# EAGLE schematic apa102-controller (EAGLE 7.1.0)
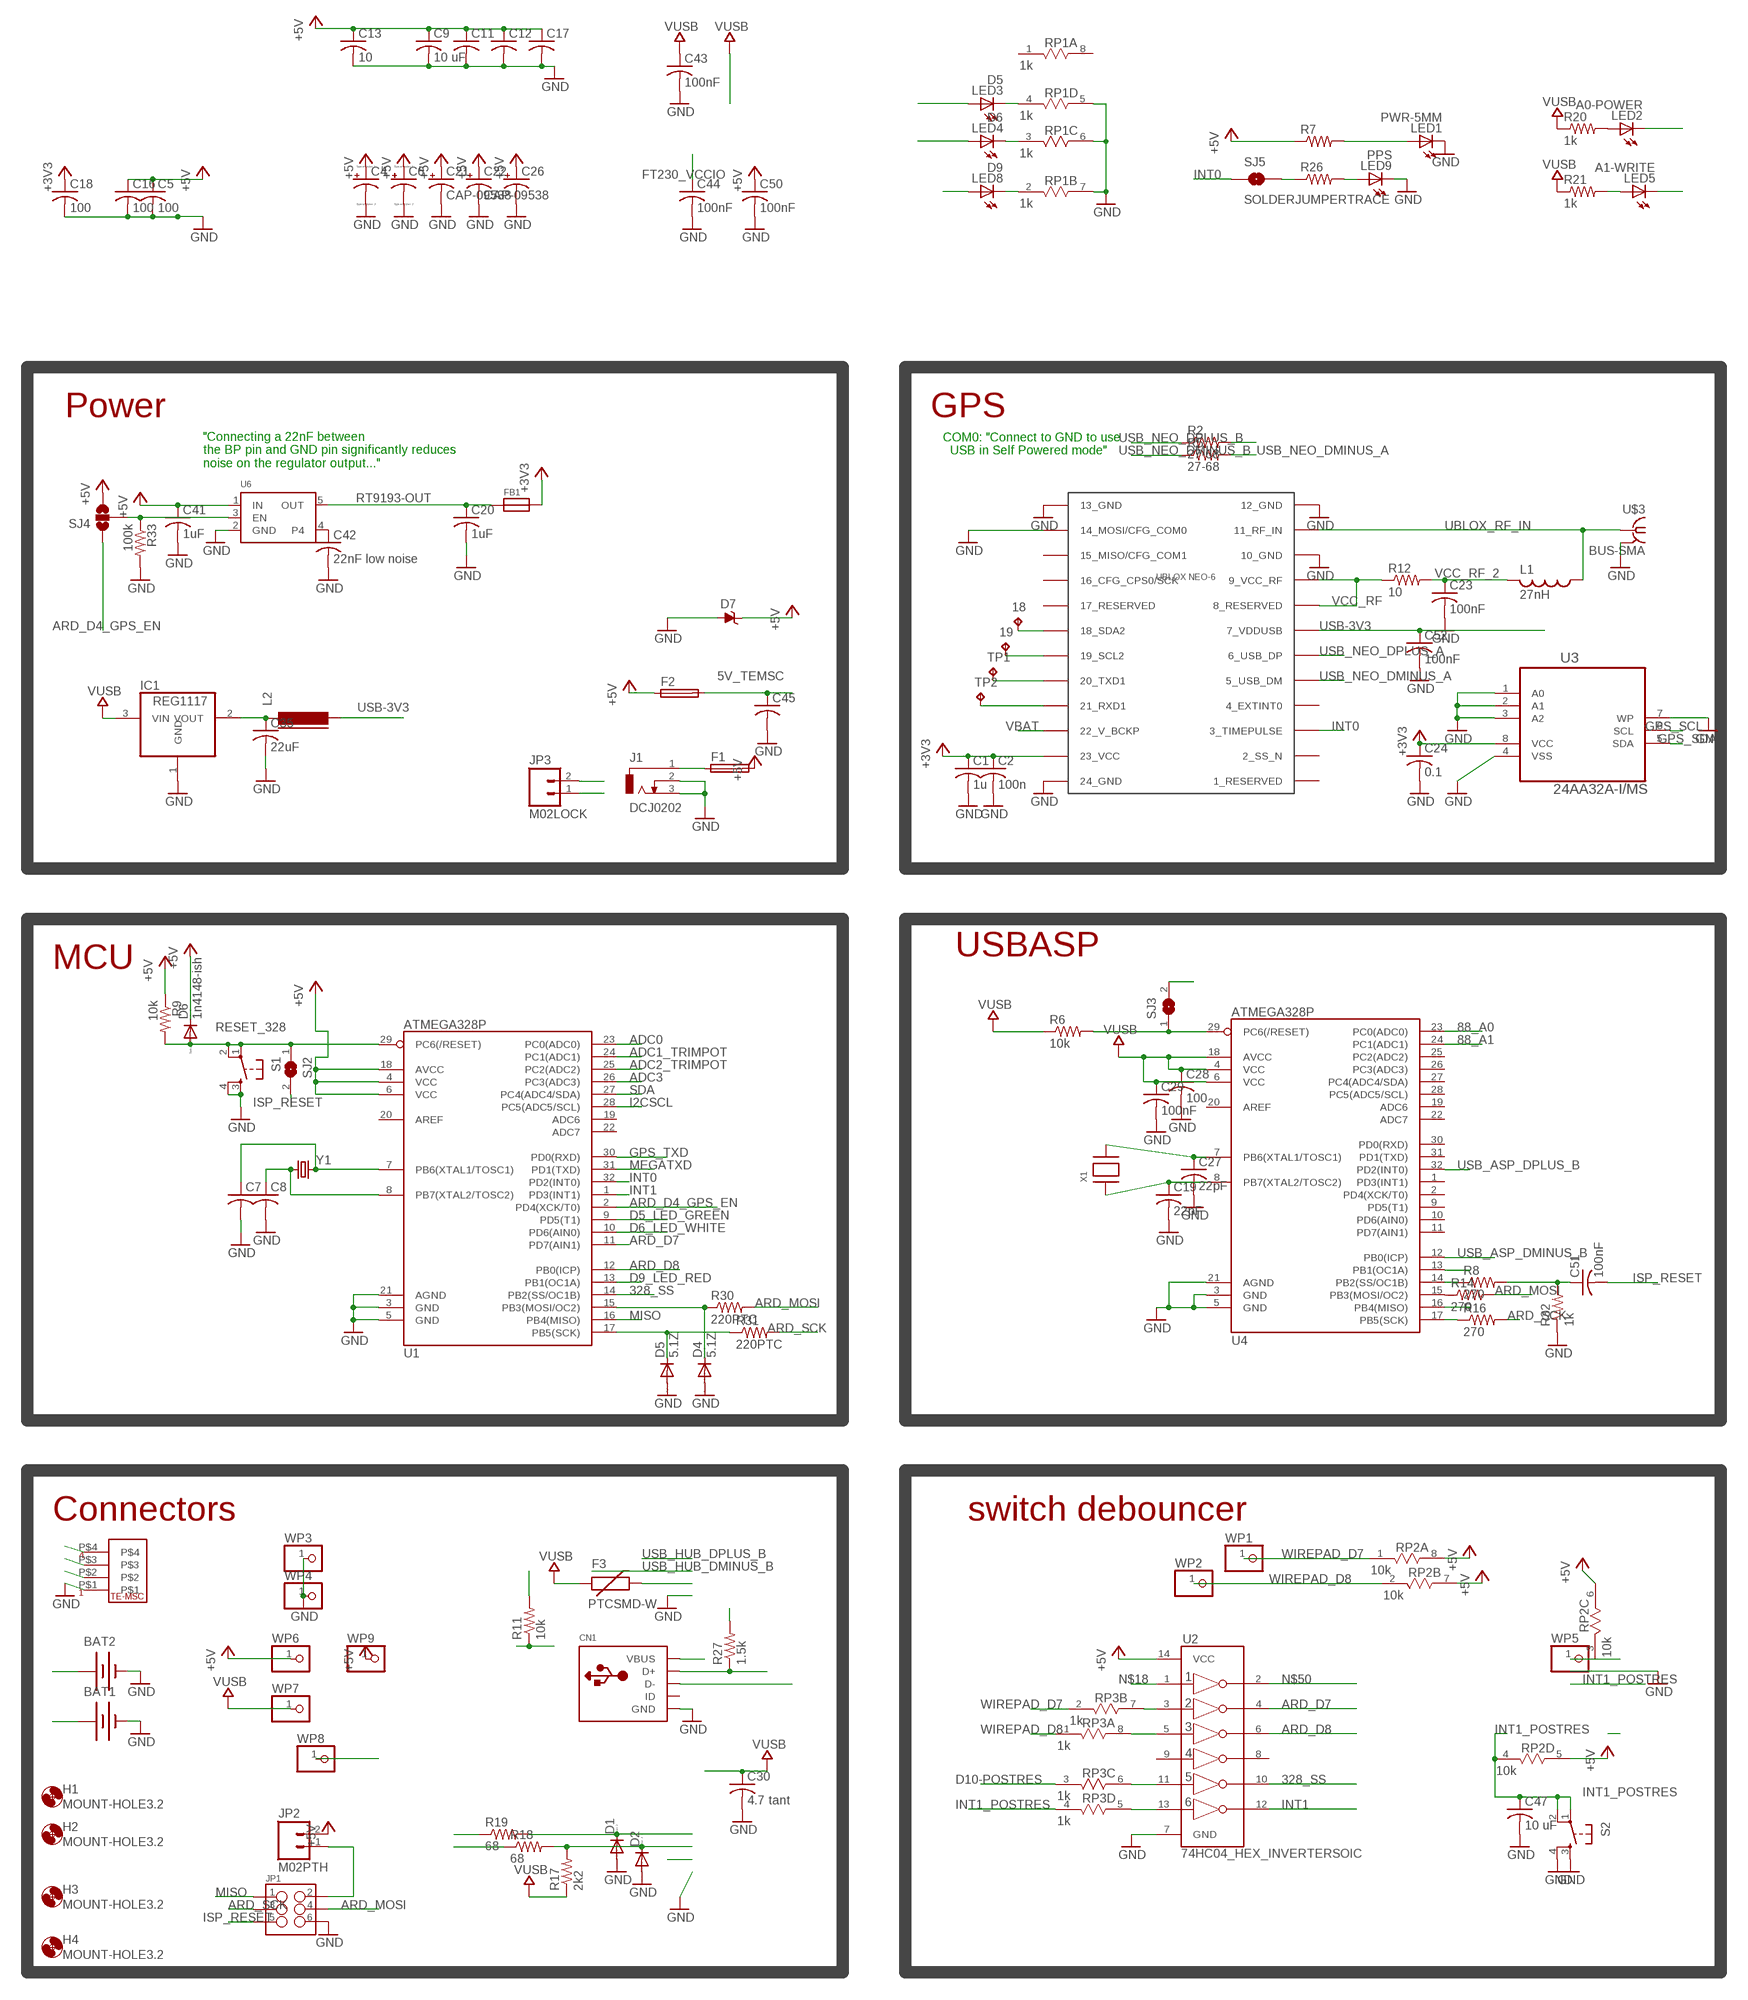
[diagram p0: schematic, sheet 1, part 1 of 2]
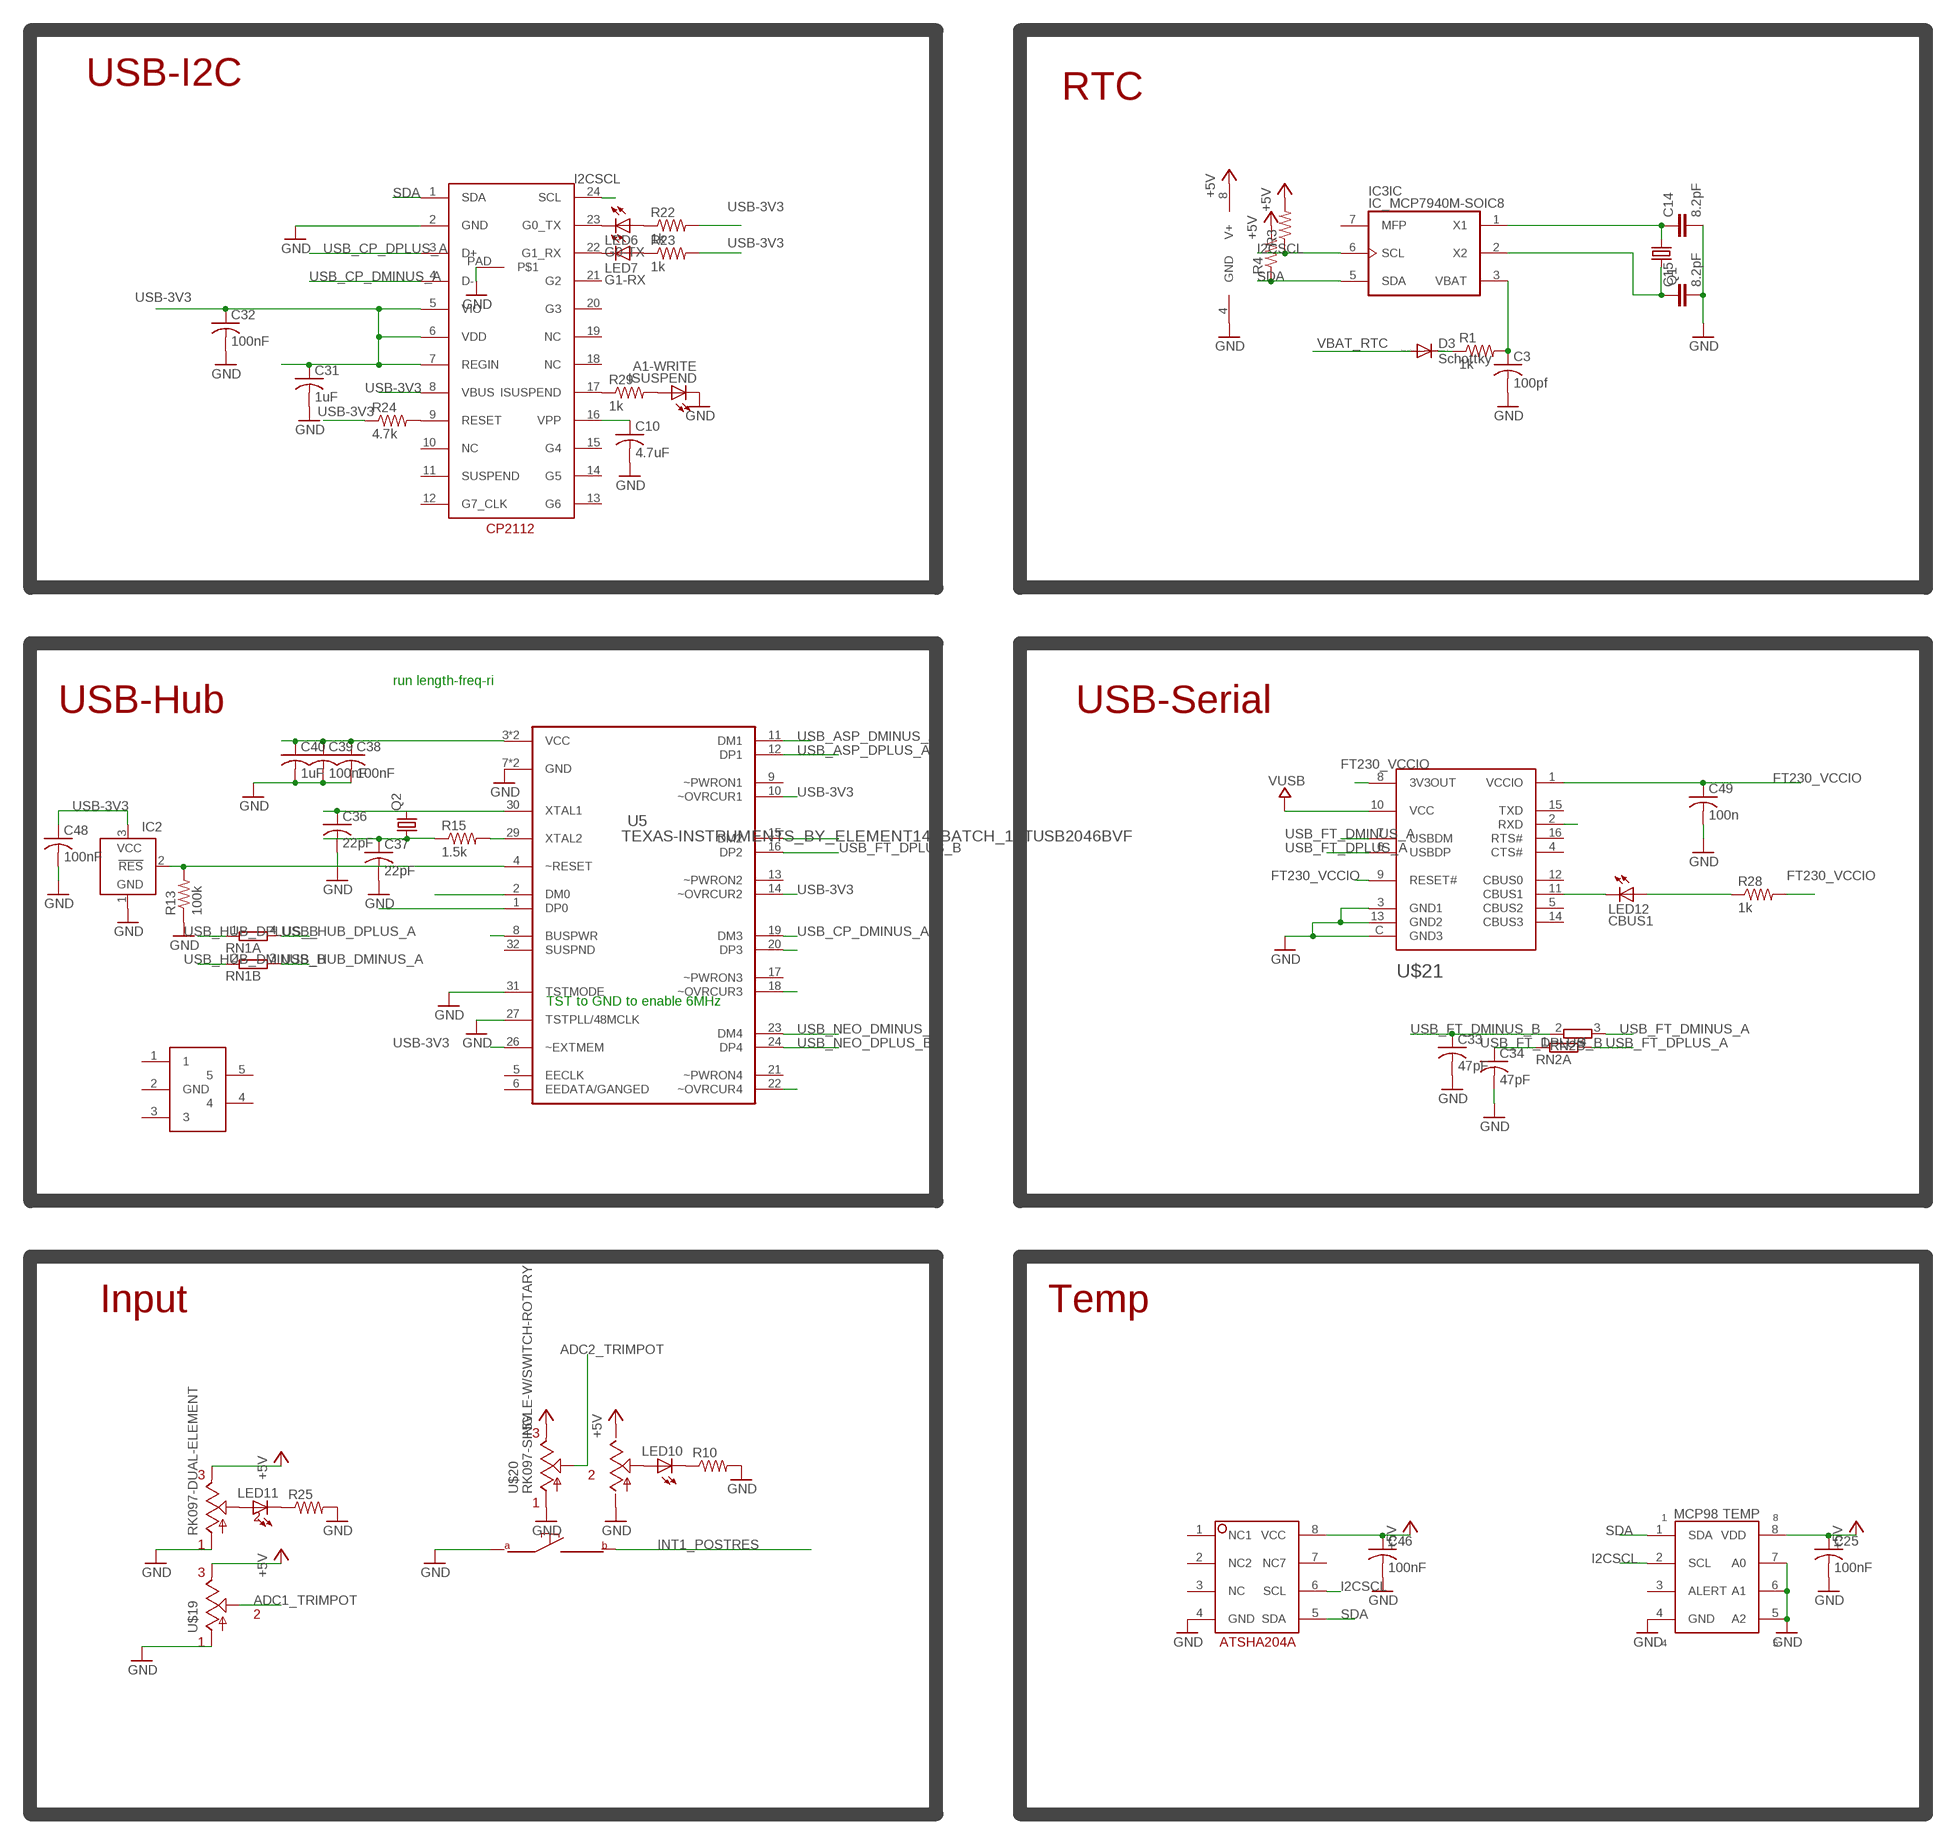
[diagram p1: schematic, sheet 1, part 2 of 2]

## Parts
18  TPTP10SQ  [TP10SQ]
19  TPTP10SQ  [TP10SQ]
BAT1  BATTERY12MM  [BATTCON_12MM]
BAT2  BATTERY12MM  [BATTCON_12MM]
C1  1u  C-USC0805  [C0805]
C2  100n  C-USC0805  [C0805]
C3  100pf  C-USC0805  [C0805]
C4  CPOL-USE5-5  [E5-5]
C5  100  C-USC0805  [C0805]
C6  CPOL-USE5-5  [E5-5]
C7  C-USC0805  [C0805]
C8  C-USC0805  [C0805]
C9  10 uF  C-USC0805  [C0805]
C10  4.7uF  C-USC0805  [C0805]
C11  C-USC0805  [C0805]
C12  C-USC0805  [C0805]
C13  10  C-USC0805  [C0805]
C14  8.2pF  CAP0603-CAP  [0603-CAP]
C15  8.2pF  CAP0603-CAP  [0603-CAP]
C16  100  C-USC0805  [C0805]
C17  C-USC0805  [C0805]
C18  100  C-USC0805  [C0805]
C19  22pF  C-USC0805  [C0805]
C20  1uF  C-USC0805  [C0805]
C21  CAP-09538  1000UF-25V(PTH)  [CPOL-RADIAL-1000UF-25V]
C22  CAP-09538  1000UF-25V(PTH)  [CPOL-RADIAL-1000UF-25V]
C23  100nF  C-USC0805  [C0805]
C24  0.1  C-USC0805  [C0805]
C25  100nF  C-USC0805  [C0805]
C26  10UF-25V-20%(PTH)KIT  [CPOL-RADIAL-10UF-25V-KIT]
C27  22pF  C-USC0805  [C0805]
C28  100  C-USC0805  [C0805]
C29  100nF  C-USC0805  [C0805]
C30  4.7 tant  C-USC0805  [C0805]
C31  1uF  C-USC0805  [C0805]
C32  100nF  C-USC0805  [C0805]
C33  47pF  C-USC0805  [C0805]
C34  47pF  C-USC0805  [C0805]
C35  22uF  C-USC0805  [C0805]
C36  22pF  C-USC0805  [C0805]
C37  22pF  C-USC0805  [C0805]
C38  100nF  C-USC0805  [C0805]
C39  100nF  C-USC0805  [C0805]
C40  1uF  C-USC0805  [C0805]
C41  1uF  C-USC0805  [C0805]
C42  22nF low noise  C-USC0805  [C0805]
C43  100nF  C-USC0805  [C0805]
C44  100nF  C-USC0805  [C0805]
C45  C-USC1206K  [C1206K]
C46  100nF  C-USC0805  [C0805]
C47  10 uF  C-USC0805  [C0805]
C48  100nF  C-USC0805  [C0805]
C49  100n  C-USC0805  [C0805]
C50  100nF  C-USC0805  [C0805]
C51  100nF  C-USC0805  [C0805]
C52  100nF  C-USC0805  [C0805]
CN1  USBMINIB  [USB-MINIB]
D1  DIODE-MINIMELF  [MINIMELF@1]
D2  DIODE-MINIMELF  [MINIMELF@1]
D3  Schottky  DIODE-SOD323-W  [SOD323-W@1]
D4  5.1Z  DIODE-SOD323-W  [SOD323-W@1]
D5  5.1Z  DIODE-SOD323-W  [SOD323-W@1]
D6  1n4148-ish  DIODE-SOD323-W  [SOD323-W@1]
D7  ZENER-DIODEDO41Z10  [DO41Z10]
F1  LITTLEFUSE  [LITTLEFUSE]
F2  LITTLEFUSE  [LITTLEFUSE]
F3  PTCSMD-W  [PTC-1206-WIDE]
FB1  FERRITE0805  [0805]
H1  MOUNT-HOLE3.2  [3,2]
H2  MOUNT-HOLE3.2  [3,2]
H3  MOUNT-HOLE3.2  [3,2]
H4  MOUNT-HOLE3.2  [3,2]
IC1  REG1117  [SOT223]
IC2  TCM809  [SOT23B-3]
IC3  IC_MCP7940M-SOIC8  [SOIC-8]
ISUSPEND  A1-WRITE  LEDCHIP-LED0805  [CHIP-LED0805]
J1  DCJ0202  [DCJ0202]
JP1  M03X2SHROUD  [2X3-SHROUDED]
JP2  M02PTH  [1X02]
JP3  M02LOCK  [1X02_LOCK]
L1  27nH  INDUCTORM0805  [M0805]
L2  FERRITE-1206  [FB1206]
LED1  PWR-5MM  LED5MM  [LED5MM]
LED2  A0-POWER  LEDCHIP-LED0805  [CHIP-LED0805]
LED3  D5  LEDCHIP-LED0805  [CHIP-LED0805]
LED4  D6  LEDCHIP-LED0805  [CHIP-LED0805]
LED5  A1-WRITE  LEDCHIP-LED0805  [CHIP-LED0805]
LED6  G0-TX  LEDCHIP-LED0805  [CHIP-LED0805]
LED7  G1-RX  LEDCHIP-LED0805  [CHIP-LED0805]
LED8  D9  LEDCHIP-LED0805  [CHIP-LED0805]
LED9  PPS  LEDCHIP-LED0805  [CHIP-LED0805]
LED10  LEDCHIP-LED0805  [CHIP-LED0805]
LED11  LEDCHIP-LED0805  [CHIP-LED0805]
LED12  CBUS1  LEDCHIP-LED0805  [CHIP-LED0805]
Q1  CRYSTALMM20SS  [MM20SS]
Q2  CRYSTALHC49UP  [HC49UP]
R1  1k  R-US_R0805  [R0805]
R2  27-68  R-US_R0805  [R0805]
R3  R-US_R0805  [R0805]
R4  R-US_R0805  [R0805]
R5  27-68  R-US_R0805  [R0805]
R6  10k  R-US_R0805  [R0805]
R7  R-US_R0805  [R0805]
R8  270  R-US_R0805  [R0805]
R9  10k  R-US_R0805  [R0805]
R10  R-US_R0805  [R0805]
R11  10k  R-US_R0805  [R0805]
R12  10  R-US_R0805  [R0805]
R13  100k  R-US_R0805  [R0805]
R14  270  R-US_R0805  [R0805]
R15  1.5k  R-US_R0805  [R0805]
R16  270  R-US_R0805  [R0805]
R17  2k2  R-US_R0805  [R0805]
R18  68  R-US_R0805  [R0805]
R19  68  R-US_R0805  [R0805]
R20  1k  R-US_R0805  [R0805]
R21  1k  R-US_R0805  [R0805]
R22  1k  R-US_R0805  [R0805]
R23  1k  R-US_R0805  [R0805]
R24  4.7k  R-US_R0805  [R0805]
R25  R-US_R0805  [R0805]
R26  R-US_R0805  [R0805]
R27  1.5k  R-US_R0805  [R0805]
R28  1k  R-US_R0805  [R0805]
R29  1k  R-US_R0805  [R0805]
R30  220PTC  RESISTOR0603-RES  [0603-RES]
R31  220PTC  RESISTOR0603-RES  [0603-RES]
R32  1k  R-US_R0805  [R0805]
R33  100k  R-US_R0805  [R0805]
RN1  2R-NEXBV4V  [EXBV4V]
RN2  2R-NEXBV4V  [EXBV4V]
RP1  1k  RES4NT  [RES4NT]
RP2  10k  RES4NT  [RES4NT]
RP3  1k  RES4NT  [RES4NT]
S1  TAC_SWITCHSMD  [TACTILE-SWITCH-SMD]
S2  TAC_SWITCHSMD  [TACTILE-SWITCH-SMD]
SJ2  SJ  [SJ]
SJ3  SJ  [SJ]
SJ4  SOLDERJUMPER_2WAYT  [SJ_2]
SJ5  SOLDERJUMPERTRACE  [SJ_2S-TRACE]
TP1  TPTP10SQ  [TP10SQ]
TP2  TPTP10SQ  [TP10SQ]
U1  ATMEGA328P  ATMEGA328_SMT  [TQFP32-08]
U2  74HC04_HEX_INVERTERSOIC  [SOIC-14]
U3  24AA32A-I/MS  [SOP65P490X110-8N]
U4  ATMEGA328P  ATMEGA328_SMT  [TQFP32-08]
U5  TEXAS-INSTRUMENTS_BY_ELEMENT14_BATCH_1_TUSB2046BVF  [TEXAS-INSTRUMENTS_BY_ELEMENT14_BATCH_1_QFP80P900X900X145-32N]
U6  VREG_SOT23-5  [SOT23-5]
U$2  UBLOX_NEO-6  [UBLOX_NEO-6P]
U$3  BUS-SMA  [BUS-SMA]
U$7  MCP98  [MSOP08]
U$11  CP2112  [QFN-24]
U$17  TE-MSC-4POS-6A  [TE-MSC-4POS-6A]
U$18  ATSHA204A  [SO08]
U$19  RK097-DUAL-ELEMENT  [RK097-DUAL-ELEMENT]
U$20  RK097-SINGLE-W/SWITCH-ROTARY  [RK097-DUAL-ELEMENT-W/SWITCH]
U$21  FT230XQ  [QFN4X4-16]
U$23  ESDTUDOR  [SOT23-5L]
WP1  WPAD-1-PTH  [WPAD-1-PTH-2.54]
WP2  WPAD-1-PTH  [WPAD-1-PTH-2.54]
WP3  WPAD-1-PTH  [WPAD-1-PTH-2.54]
WP4  WPAD-1-PTH  [WPAD-1-PTH-2.54]
WP5  WPAD-1-PTH  [WPAD-1-PTH-2.54]
WP6  WPAD-1-PTH  [WPAD-1-PTH-2.54]
WP7  WPAD-1-PTH  [WPAD-1-PTH-2.54]
WP8  WPAD-1-PTH  [WPAD-1-PTH-2.54]
WP9  WPAD-1-PTH  [WPAD-1-PTH-2.54]
X1  XTALNX5032  [NX5032]
Y1  CRYSTALABM2  [CRYSTAL-ABRACON-ABM2]

## Nets
5V_TEMSC: C45.1 F2.2 U$17.P$4
88_A0: LED2.C U4.23(PC0(ADC0))
88_A1: LED5.C U4.24(PC1(ADC1))
328_SS: U1.14(PB2(SS/OC1B)) U2.10(5Y)
+3V3: C1.1 C2.1 C18.1 C24.1 FB1.2 U3.8(VCC) U$2.23_VCC
+5V: C4.+ C5.1 C6.+ C9.1 C11.1 C12.1 C13.1 C16.1 C17.1 C21.+ C22.+ C25.1 C26.1(+) C41.1 C46.1 C50.1 D6.C D7.C F1.2 F2.1 IC3.8(SUPPLY:V+) JP2.2 R3.2 R4.2 R7.1 R9.1 RP2.5 RP2.6 RP2.7 RP2.8 SJ4.3 U1.4(VCC) U1.6(VCC) U1.18(AVCC) U2.14(VCC) U6.1(IN) U$7.8(VDD) U$18.8(VCC) U$19.P$3(E1) U$19.P$6(E) U$20.P$3(E) U$20.P$6(E1) WP6.1 WP9.1
ADC0: U1.23(PC0(ADC0))
ADC1_TRIMPOT: U1.24(PC1(ADC1)) U$19.P$5(S1)
ADC2_TRIMPOT: U1.25(PC2(ADC2)) U$20.P$2(S)
ADC3: U1.26(PC3(ADC3))
ARD_D4_GPS_EN: R33.1 SJ4.1 SJ4.2 U1.2(PD4(XCK/T0)) U6.3(EN)
ARD_D7: U1.11(PD7(AIN1)) U2.4(2Y)
ARD_D8: U1.12(PB0(ICP)) U2.6(3Y)
ARD_MOSI: JP1.4 R14.2 R30.2 U$17.P$2
ARD_SCK: JP1.3 R16.2 R31.2 U$17.P$3
D5_LED_GREEN: LED3.A U1.9(PD5(T1))
D6_LED_WHITE: LED4.A U1.10(PD6(AIN0))
D9_LED_RED: LED8.A U1.13(PB1(OC1A))
D10-POSTRES: RP2.3 RP3.3 WP5.1
DCJACK_TO_PTC: F1.1 J1.1 JP3.1
FT230_VCCIO: C44.1 C49.1 R11.2 R28.2 U$21.1(VCCIO) U$21.8(3V3OUT) U$21.9(RESET#)
FT_CB0: LED12.C U$21.11(CBUS1)
GND: BAT1.GND(-) BAT2.GND(-) C1.2 C2.2 C3.2 C4.- C5.2 C6.- C7.2 C8.2 C9.2 C10.2 C11.2 C12.2 C13.2 C14.2 C15.2 C16.2 C17.2 C18.2 C19.2 C20.2 C21.- C22.- C23.2 C24.2 C25.2 C26.2(-) C27.2 C28.2 C29.2 C30.2 C31.2 C32.2 C33.2 C34.2 C35.2 C36.2 C37.2 C38.2 C39.2 C40.2 C41.2 C42.2 C43.2 C44.2 C45.2 C46.2 C47.2 C48.2 C49.2 C50.2 C52.2 CN1.GND D1.A D2.A D4.A D5.A D7.A IC1.1(GND) IC2.1(GND) IC3.4(SUPPLY:GND) ISUSPEND.C J1.2 J1.3 JP1.6 JP3.2 LED1.K(C) LED9.C R10.2 R13.1 R25.2 R32.1 R33.2 RP1.5 RP1.6 RP1.7 S1.3 S1.4 S2.3 S2.4 U1.3(GND) U1.5(GND) U1.21(AGND) U2.7(GND) U3.1(A0) U3.2(A1) U3.3(A2) U3.4(VSS) U3.7(WP) U4.3(GND) U4.5(GND) U4.21(AGND) U5.7(GND) U5.27(TSTPLL/48MCLK) U5.28(GND) U5.31(TSTMODE) U6.2(GND) U$2.10_GND U$2.12_GND U$2.13_GND U$2.14_MOSI/CFG_COM0 U$2.24_GND U$3.2(GND) U$3.3(GND) U$3.4(GND) U$3.5(GND) U$7.4(GND) U$7.5(A2) U$7.6(A1) U$7.7(A0) U$11.2(GND) U$11.PAD U$17.P$1 U$18.4(GND) U$19.P$1(A1) U$19.P$4(A) U$20.P$1(A) U$20.P$4(A1) U$20.P$7(SW1) U$21.3(GND1) U$21.13(GND2) U$21.C(GND3) WP3.1 WP4.1
GPS_RXD: TP2.TP U$2.21_RXD1
GPS_SCL: 19.TP U3.6(SCL) U$2.19_SCL2
GPS_SDA: 18.TP U3.5(SDA) U$2.18_SDA2
GPS_TXD: TP1.TP U1.30(PD0(RXD)) U$2.20_TXD1
HEX3: RP3.7 U2.3(2A)
HEX5: RP3.8 U2.5(3A)
HEX11: RP3.6 U2.11(5A)
HEX13: RP3.5 U2.13(6A)
I2CSCL: IC3.6(IC:SCL) R3.1 U1.28(PC5(ADC5/SCL)) U$7.2(SCL) U$11.24(SCL) U$18.6(SCL)
INT0: SJ5.1 U1.32(PD2(INT0)) U$2.3_TIMEPULSE
INT1: U1.1(PD3(INT1)) U2.12(6Y)
INT1_POSTRES: C47.1 RP2.4 RP3.4 S2.1 S2.2 U$20.P$8(SW2)
ISP_RESET: C51.2 JP1.5 SJ2.2 SJ3.2
MEGATXD: R11.1 U1.31(PD1(TXD)) U$21.2(RXD)
MISO: JP1.1 U1.16(PB4(MISO)) U4.16(PB4(MISO))
N$1: C3.1 IC3.3(IC:VBAT) R1.2
N$2: D3.C R1.1
N$3: C35.1 IC1.2(VOUT) L2.1
N$4: LED10.A U$20.P$5(S1)
N$5: C42.1 U6.4
N$9: LED1.A R7.2
N$11: D4.C R30.1 U1.15(PB3(MOSI/OC2))
N$13: IC2.2(!RES) R13.2 U5.4(~RESET)
N$14: C7.1 U1.7(PB6(XTAL1/TOSC1)) Y1.P$2
N$15: C8.1 U1.8(PB7(XTAL2/TOSC2)) Y1.P$1
N$16: C14.1 IC3.1(IC:X1) Q1.1
N$17: C15.1 IC3.2(IC:X2) Q1.4
N$18: U2.1(1A)
N$19: LED3.C RP1.4
N$20: LED4.C RP1.3
N$21: LED10.C R10.1
N$22: R15.2 U5.29(XTAL2)
N$23: LED11.A U$19.P$2(S)
N$24: LED11.C R25.1
N$27: LED6.C U$11.23(G0_TX)
N$28: LED7.C U$11.22(G1_RX)
N$29: R6.2 SJ3.1 U4.29(PC6(/RESET))
N$30: C19.1 U4.8(PB7(XTAL2/TOSC2)) X1.P$1
N$31: C27.1 U4.7(PB6(XTAL1/TOSC1)) X1.P$2
N$32: R8.1 U4.14(PB2(SS/OC1B))
N$33: R14.1 U4.15(PB3(MOSI/OC2))
N$34: R16.1 U4.17(PB5(SCK))
N$35: C36.1 Q2.2 U5.30(XTAL1)
N$36: C37.1 Q2.1 R15.1
N$39: JP1.2 JP2.1
N$40: LED2.A R20.2
N$41: LED5.A R21.2
N$42: LED6.A R22.1
N$43: LED7.A R23.1
N$44: R24.2 U$11.9(RESET)
N$45: C10.1 U$11.16(VPP)
N$46: R29.1 U$11.17(ISUSPEND)
N$47: LED8.C RP1.2
N$48: ISUSPEND.A R29.2
N$50: U2.2(1Y)
N$51: D5.C R31.1 U1.17(PB5(SCK))
N$52: LED9.A R26.2
N$53: R26.1 SJ5.2
N$54: C51.1 R8.2 R32.2
N$58: LED12.A R28.1
RESET_328: D6.A R9.2 S1.1 S1.2 SJ2.1 U1.29(PC6(/RESET))
RT9193-OUT: C20.1 FB1.1 U6.5(OUT)
SDA: IC3.5(IC:SDA) R4.1 U1.27(PC4(ADC4/SDA)) U$7.1(SDA) U$11.1(SDA) U$18.5(SDA)
UBLOX_RF_IN: L1.1 U$2.11_RF_IN U$3.1
USB-3V3: C31.1 C32.1 C38.1 C39.1 C40.1 C48.1 C52.1 IC2.3(VCC) L2.2 R22.2 R23.2 R24.1 R27.2 U5.3(VCC) U5.8(BUSPWR) U5.10(~OVRCUR1) U5.14(~OVRCUR2) U5.18(~OVRCUR3) U5.22(~OVRCUR4) U5.25(VCC) U5.26(~EXTMEM) U$2.7_VDDUSB U$11.5(VIO) U$11.6(VDD) U$11.7(REGIN) U$11.8(VBUS) WP8.1
USB_ASP_DMINUS_A: D2.C R17.2 R18.2 U5.11(DM1)
USB_ASP_DMINUS_B: R18.1 U4.12(PB0(ICP))
USB_ASP_DPLUS_A: D1.C R19.2 U5.12(DP1)
USB_ASP_DPLUS_B: R19.1 U4.13(PB1(OC1A)) U4.32(PD2(INT0))
USB_CP_DMINUS_A: U5.19(DM3) U$11.4(D-)
USB_CP_DPLUS_A: U5.20(DP3) U$11.3(D+)
USB_FT_DMINUS_A: RN2.3 U$21.7(USBDM)
USB_FT_DMINUS_B: C33.1 RN2.2 U5.15(DM2)
USB_FT_DPLUS_A: RN2.4 U$21.6(USBDP)
USB_FT_DPLUS_B: C34.1 RN2.1 U5.16(DP2)
USB_HUB_DMINUS_A: RN1.3 U5.2(DM0)
USB_HUB_DMINUS_B: CN1.D- RN1.2
USB_HUB_DPLUS_A: RN1.4 U5.1(DP0)
USB_HUB_DPLUS_B: CN1.D+ R27.1 RN1.1
USB_NEO_DMINUS_A: R5.2 U$2.5_USB_DM
USB_NEO_DMINUS_B: R5.1 U5.23(DM4)
USB_NEO_DPLUS_A: R2.2 U$2.6_USB_DP
USB_NEO_DPLUS_B: R2.1 U5.24(DP4)
USB_RAW_5V: CN1.VBUS F3.2
VBAT: BAT1.PWR@1(+) U$2.22_V_BCKP
VBAT_RTC: BAT2.PWR@1(+) D3.A
VCC_RF: R12.1 U$2.8_RESERVED U$2.9_VCC_RF
VCC_RF_2: C23.1 L1.2 R12.2
VUSB: C28.1 C29.1 C30.1 C43.1 F3.1 IC1.3(VIN) R6.1 R17.1 R20.1 R21.1 U4.4(VCC) U4.6(VCC) U4.18(AVCC) U$21.10(VCC) WP7.1
WIREPAD_D7: RP2.1 RP3.2 WP1.1
WIREPAD_D8: RP2.2 RP3.1 WP2.1
Unconnected: CN1.ID IC3.7(IC:MFP) RP1.1 RP1.8 U1.19(ADC6) U1.20(AREF) U1.22(ADC7) U2.8(4Y) U2.9(4A) U4.1(PD3(INT1)) U4.2(PD4(XCK/T0)) U4.9(PD5(T1)) U4.10(PD6(AIN0)) U4.11(PD7(AIN1)) U4.19(ADC6) U4.20(AREF) U4.22(ADC7) U4.25(PC2(ADC2)) U4.26(PC3(ADC3)) U4.27(PC4(ADC4/SDA)) U4.28(PC5(ADC5/SCL)) U4.30(PD0(RXD)) U4.31(PD1(TXD)) U5.5(EECLK) U5.6(EEDATA/GANGED) U5.9(~PWRON1) U5.13(~PWRON2) U5.17(~PWRON3) U5.21(~PWRON4) U5.32(SUSPND) U$2.1_RESERVED U$2.2_SS_N U$2.4_EXTINT0 U$2.15_MISO/CFG_COM1 U$2.16_CFG_CPS0/SCK U$2.17_RESERVED U$7.3(ALERT) U$11.10(NC) U$11.11(SUSPEND) U$11.12(G7_CLK) U$11.13(G6) U$11.14(G5) U$11.15(G4) U$11.18(NC) U$11.19(NC) U$11.20(G3) U$11.21(G2) U$18.1(NC1) U$18.2(NC2) U$18.3(NC) U$18.7(NC7) U$21.4(CTS#) U$21.5(CBUS2) U$21.12(CBUS0) U$21.14(CBUS3) U$21.15(TXD) U$21.16(RTS#) U$23.1 U$23.2(GND) U$23.3 U$23.4 U$23.5

## Notes on the sheet
- Power | GPS | USB-I2C
- RTC
- COM0: "Connect to GND to use
    USB in Self Powered mode"
- "Connecting a 22nF between
  the BP pin and GND pin significantly reduces
  noise on the regulator output..."
- USBASP | run length-freq-ri
- MCU
- USB-Hub | USB-Serial
- TST to GND to enable 6MHz
- Connectors | switch debouncer | Input | Temp

## Library data of the parts
18 19 TP1 TP2 = testpad:TP: Test pad
BAT1 BAT2 = cargpspa6h:BATTERY: Battery Holders Various common sizes : AA, AAA, 20mm coin cell and 12mm coin cell. 20MM_4LEGS, BATT-10373
C1-C3 C5 C7-C13 C16-C20 C23-C25 C27-C44 C46-C52 = rcl:C-US: CAPACITOR, American symbol
C4 C6 = resistor:CPOL-US: POLARIZED CAPACITOR, American symbol
C14 C15 = SparkFun-Passives:CAP: Capacitor Standard 0603 ceramic capacitor, and 0.1" leaded capacitor.
C21 C22 = SparkFun-Capacitors:1000UF-25V(PTH): CAP-08070; PROD_ID: CAP-09538
C26 = SparkFun-Capacitors:10UF-25V-20%(PTH): CAP-08440; PROD_ID: CAP-08440
C45 = mini1284:C-US: CAPACITOR, American symbol
CN1 = adafruit:USB: USB Connectors USBMINIB - Surface Mount Female Mini-B USB Connector 4UConnector: 06564 By microbuilder.eu Thru-hole RA Female Mini-B USB Connector 4UConnector: 18732 By ladyada.net
D1-D6 = diode:DIODE-: DIODE
D7 = diode:ZENER-DIODE: Z-Diode
F1 F2 = fuse:LITTLEFUSE: LITTLEFUSE Picofuse/slow Littlefuse; OC_FARNELL: unknown; OC_NEWARK: unknown
F3 = SparkFun-PowerIC:PTC: Resettable Fuse PTC Resettable Fuse. Spark Fun Electronics SKU : COM-08357
FB1 = cargpspa6h:FERRITE: Ferrite Bead 0603 MMZ1608B121C - 120 Ohm, 600mA Ferrite Chip - Digikey: 445-2164-1-ND BK1608HW121-T - 120 Ohm, 600mA Ferrite Chip - Digikey: 587-1876-2-ND
H1-H4 = holes:MOUNT-HOLE: MOUNTING HOLE with drill center marker
IC1 = burr-brown:REG1117: 800mA and 1A Low Dropout (LDO) Positive Regulator 1.8V, 2.5V, 2.85V, 3.3V, 5V, and Adj; MPN: REG1117; OC_FARNELL: 1097566; OC_NEWARK: 14P6981
IC2 = telcom:TCM809: POWER SUPPLY MONITOR replacement for Maxim MAX809 and MAX810; MF: MICROCHIP; MPN: TCM809MENB713; OC_FARNELL: 9762744; OC_NEWARK: 96K3998
IC3 = dp_devices:IC_MCP7940M: I2C RTC/C with SRAM MCP7940M <http://www.microchip.com/wwwproducts/Devices.aspx?dDocName=en557488>
ISUSPEND LED1-LED12 = adafruit:LED: LED OSRAM: - CHIPLED LG R971, LG N971, LY N971, LG Q971, LY Q971, LO R971, LY R971 LH N974, LH R974 LS Q976, LO Q976, LY Q976 LO Q996 - Hyper CHIPLED LW Q18S LB Q993, LB Q99A, LB R99A - SideLED LS A670, LO A670, LY A670, LG A670, LP A670 LB A673, LV A673, LT A673, LW A673 LH A674 LY A675 LS A676, LA A676, LO A676, LY A676, LW A676 LS A679, LY A679, LG A679 - Hyper Micro SIDELED® LS Y876, LA Y876, LO Y876, LY Y876 LT Y87S - SmartLED LW L88C, LW L88S LB L89C, LB L89S, LG L890 LS L89K, LO L89K, LY L89K LS L896, LA L896, LO L896, LY L896 - TOPLED LS T670, LO T670, LY T670, LG T670, LP T670 LSG T670, LSP T670, LSY T670, LOP T670, LYG T670 LG T671, LOG T671, LSG T671 LB T673, LV T673, LT T673, LW T673 LH T674 LS T676, LA T676, LO T676, LY T676, LB T676, LH T676, LSB T676, LW T676 LB T67C, LV T67C, LT T67C, LS T67K, LO T67K, LY T67K, LW E67C LS E67B, LA E67B, LO E67B, LY E67B, LB E67C, LV E67C, LT E67C LW T67C LS T679, LY T679, LG T679 LS T770, LO T770, LY T770, LG T770, LP T770 LB T773, LV T773, LT T773, LW T773 LH T774 LS E675, LA E675, LY E675, LS T675 LS T776, LA T776, LO T776, LY T776, LB T776 LHGB T686 LT T68C, LB T68C - Hyper Mini TOPLED® LB M676 - Mini TOPLED Santana® LG M470 LS M47K, LO M47K, LY M47K Source: http://www.osram.convergy.de/
J1 = con-jack:DCJ0202: DC POWER JACK Source: DCJ0202.pdf
JP1 = SparkFun-Connectors:M03X2: 2x3 .1" header. Shrouded, with keying- CONN-10681 SMT- CONN-11415 Pogo pins- HW-11044; PROD_ID: CONN-10681
JP2 JP3 = SparkFun-Connectors:M02: Standard 2-pin 0.1" header. Use with - straight break away headers ( PRT-00116) - right angle break away headers (PRT-00553) - swiss pins (PRT-00743) - machine pins (PRT-00117) - female headers (PRT-00115) Molex polarized connector foot print use with: PRT-08233 with associated crimp pins and housings. 2.54_SCREWTERM for use with PRT-10571. 3.5mm Screw Terminal footprints for PRT-08084 5mm Screw Terminal footprints for use with PRT-08432
L1 = mini1284:INDUCTOR: Murata #11R472C
L2 = dp_devices:FERRITE: Ferrite bead in various packages
Q1 = crystal:CRYSTAL: CRYSTAL; OC_FARNELL: unknown; OC_NEWARK: unknown
Q2 = adafruit:CRYSTAL: CRYSTAL; OC_FARNELL: unknown; OC_NEWARK: unknown
R1-R29 R32 R33 = rcl:R-US_: RESISTOR, American symbol
R30 R31 = SparkFun-Passives:RESISTOR: Resistor Basic schematic elements and footprints for 0603, 1206, and PTH resistors.
RN1 RN2 = resistor-dil:2R-N: Array Chip Resistor Source: Panasonic; OC_FARNELL: unknown; OC_NEWARK: unknown
RP1-RP3 = Arduino Neo:RES4NT
S1 S2 = SparkFun-Electromechanical:TAC_SWITCH: Momentary Switch Button commonly used for reset or general input. Spark Fun Electronics SKU : COM-00097 SMT- SWCH-08247
SJ2 SJ3 = jumper:SJ: SMD solder JUMPER
SJ4 = SparkFun-Retired:SOLDERJUMPER_2WAY: Solder Jumper 2 way solder jumper
SJ5 = SparkFun-Retired:SOLDERJUMPER: Solder Jumper Standard SMD solder jumper. Used to automate production. Two varients : Normally Open and Normally Closed are the same, but have different paste layers. NC will have a large amount of paste and should jumper during reflow.
U1 U4 = SparkFun-DigitalIC:ATMEGA328_SMT: 32-Pin Atmega328 part Commonly used on Arduino compatible boards Available in QFP and QFN packages TQFP is IC-09069 QFN is non-stock; PROD_ID: IC-09069
U2 = SparkFun-DigitalIC:74HC04_HEX_INVERTER: 74HC04 Hex Inverter
U3 = Ava:24AA32A-I/MS: IC EEPROM 32KBIT 400KHZ; MPN: 24AA32A-I/MS; OC_FARNELL: 1331296; OC_NEWARK: 40C2562; PACKAGE: MSOP8; SUPPLIER: Microchip
U5 = freetserv:TEXAS-INSTRUMENTS_BY_ELEMENT14_BATCH_1_TUSB2046BVF: THE UNIVERSAL SERIAL BUS; MPN: TUSB2046BVF; OC_FARNELL: 1470507; OC_NEWARK: 77C1805; PACKAGE: LQFP-32; SUPPLIER: TEXAS INSTRUMENTS
U6 = cargpspa6h:VREG_SOT23-5: SOT23-5 Fixed Voltage Regulators To better organise some of the SOT23-5 fixed voltage regulators in this library, this new part was created. Part Current Out V Out V In V Dropout Digikey Part No. ADP121 150mA 3.3V 3.4-5.5V 0.09V @ 150mA ADP121-AUJZ33R7CT-ND ADP121 150mA 3.0V 3.1-5.5V 0.09V @ 150mA ADP121-AUJZ30R7CT-ND ADP122 300mA 3.3V 3.4-5.5V 0.085V @ 300mA ADP122AUJZ-3.3-R7CT-ND ADP1712 300mA 3.3V 3.5-5.5V 0.17V @ 300mA ADP1712AUJZ-3.3-R7TR-ND AP7311 (Low Cost) 150mA 3.3V 3.5-6V 0.15V @ 150mA AP7311-33WG-7DICT-ND LD39015M18R 150mA 1.8V 1.9V-5.5V 0.08V @ 100mA 497-6977-1-ND MCP1824T-3302E/OT 300mA 3.3V 3.5V-6V 0.2V @ 300mA MCP1824T-3302E/OTCT-ND MIC5205-2.5YM5 TR 150mA 2.5V 2.7-16V 0.165V @ 150mA 576-1257-2-ND MIC5205-3.0YM5 TR 150mA 3.0V 3.2V-16V 0.165V @ 150mA 576-1258-2-ND MIC5205-3.3YM5 TR 150mA 3.3V 3.5V-16V 0.165V @ 150mA 576-1259-2-ND TPS780330220 150mA 3.3V+2.2V 3.6-5.5V 250mV Max 296-23332-1-ND TDA3663/N1,135 100mA 3.3V 3.5-45V 0.18V @ 50mA 568-5343-1-ND
U$2 = Ava:UBLOX_NEO-6: UBLOX NEO-6 GPS MODULE Author Anthony Stirk / http://ava.upuaut.net http://www.u-blox.com/images/downloads/Product_Docs/LEA-6_NEO-6_MAX_HardwareIntegrationManual_%28GPS.G6-HW-09007%29.pdf http://www.u-blox.com/images/downloads/Product_Docs/NEO-6_DataSheet_%28GPS.G6-HW-09005%29.pdf
U$3 = Ava:BUS-SMA
U$7 = hallam:MCP98
U$11 = SparkFun-Sensors:CP2112
U$17 = hallam:TE-MSC-4POS-6A
U$18 = SparkFun-DiscreteSemi:ATSHA204A: ATSHA204A
U$19 = alps_japan_potentiometers:RK097-DUAL-ELEMENT: SCHEMATIC FOR DUAL POTENTIOMETER
U$20 = alps_japan_potentiometers:RK097-SINGLE-W/SWITCH-ROTARY: Shematic Single Element w/ Switch
U$21 = ftx:FT230XQ
U$23 = adafruit:ESDTUDOR: x
WP1-WP9 = PatternAgents-ProtoPads:WPAD-1: Wire Pad - Single Good for scope lead clips, test jumpers, probe points, etc. PatternAgents ProtoPads Library Schematic and PCB layout libraries for design patterns by PatternAgents. For the CADSoft Eagle CAD program : http://www.cadsoftusa.com/download-eagle/ Source LBR : http://www.patternagents.com Github : https://github.com/PatternAgents License : http://creativecommons.org/licenses/by-sa/4.0/ (Creative Commons 4.0) THIS SOFTWARE IS PROVIDED BY THE CONTRIBUTORS "AS IS" AND WITHOUT ANY EXPRESS OR IMPLIED WARRANTIES, INCLUDING, BUT NOT LIMITED TO, THE IMPLIED WARRANTIES OF MERCHANTABILITY AND FITNESS FOR A PARTICULAR PURPOSE ARE DISCLAIMED. IN NO EVENT SHALL THE COPYRIGHT OWNER OR CONTRIBUTORS BE LIABLE FOR ANY DIRECT, INDIRECT, INCIDENTAL, SPECIAL, EXEMPLARY, OR CONSEQUENTIAL DAMAGES (INCLUDING, BUT NOT LIMITED TO, PROCUREMENT OF SUBSTITUTE GOODS OR SERVICES; LOSS OF USE, DATA, OR PROFITS; OR BUSINESS INTERRUPTION) HOWEVER CAUSED AND ON ANY THEORY OF LIABILITY, WHETHER IN CONTRACT, STRICT LIABILITY, OR TORT (INCLUDING NEGLIGENCE OR OTHERWISE) ARISING IN ANY WAY OUT OF THE USE OF THIS SOFTWARE, EVEN IF ADVISED OF THE POSSIBILITY OF SUCH DAMAGE.; BOM: EXCLUDE
X1 = adafruit:XTAL: Low cost SMT crystals, no capacitors included http://www.ladyada.net/library/eagle
Y1 = mini1284:CRYSTAL

## Net classes
0 default: width 0.254 mm